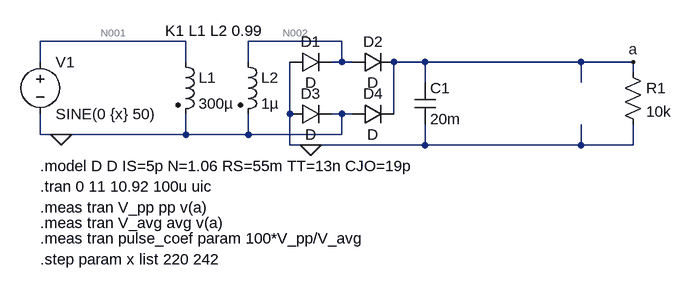
[diagram p0: schematic 2.8.1.asc]
2.8.1.asc, the LTspice schematic file:
Version 4
SHEET 1 1156 680
WIRE 320 80 96 80
WIRE 560 80 416 80
WIRE 96 112 96 80
WIRE 320 112 320 80
WIRE 416 112 416 80
WIRE 560 112 560 80
WIRE 560 112 544 112
WIRE 576 112 560 112
WIRE 688 112 640 112
WIRE 928 112 688 112
WIRE 1008 112 928 112
WIRE 1008 128 1008 112
WIRE 688 144 688 112
WIRE 928 144 928 112
WIRE 480 192 480 112
WIRE 560 192 544 192
WIRE 576 192 560 192
WIRE 640 192 640 112
WIRE 96 224 96 192
WIRE 128 224 96 224
WIRE 320 224 320 192
WIRE 320 224 128 224
WIRE 416 224 416 192
WIRE 416 224 320 224
WIRE 560 224 560 192
WIRE 560 224 416 224
WIRE 480 240 480 192
WIRE 512 240 480 240
WIRE 688 240 688 208
WIRE 688 240 512 240
WIRE 928 240 928 208
WIRE 928 240 688 240
WIRE 1008 240 1008 208
WIRE 1008 240 928 240
FLAG 128 224 0
FLAG 1008 112 a
FLAG 512 240 0
SYMBOL voltage 96 96 R0
WINDOW 123 0 0 Left 0
WINDOW 39 0 0 Left 0
SYMATTR InstName V1
SYMATTR Value SINE(0 {x} 50)
SYMBOL ind2 304 96 R0
SYMATTR InstName L1
SYMATTR Value 300µ
SYMATTR SpiceLine Rser=10m
SYMATTR Type ind
SYMBOL ind2 400 96 R0
SYMATTR InstName L2
SYMATTR Value 1µ
SYMATTR SpiceLine Rser=10m
SYMATTR Type ind
SYMBOL cap 672 144 R0
SYMATTR InstName C1
SYMATTR Value 20m
SYMBOL res 992 112 R0
SYMATTR InstName R1
SYMATTR Value 10k
SYMBOL diode 480 128 R270
WINDOW 0 32 32 VTop 2
WINDOW 3 0 32 VBottom 2
SYMATTR InstName D1
SYMBOL diode 576 128 R270
WINDOW 0 32 32 VTop 2
WINDOW 3 0 32 VBottom 2
SYMATTR InstName D2
SYMBOL diode 480 208 R270
WINDOW 0 32 32 VTop 2
WINDOW 3 0 32 VBottom 2
SYMATTR InstName D3
SYMBOL diode 576 208 R270
WINDOW 0 32 32 VTop 2
WINDOW 3 0 32 VBottom 2
SYMATTR InstName D4
TEXT 96 272 Left 2 !.model D D IS=5p N=1.06 RS=55m TT=13n CJO=19p
TEXT 288 64 Left 2 !K1 L1 L2 0.99
TEXT 96 304 Left 2 !.tran 0 11 10.92 100u uic
TEXT 96 336 Left 2 !.meas tran V_pp pp v(a)
TEXT 96 360 Left 2 !.meas tran V_avg avg v(a)
TEXT 96 384 Left 2 !.meas tran pulse_coef param 100*V_pp/V_avg
TEXT 96 416 Left 2 !.step param x list 220 242

The netlist it stands for:
* 2.8.1.asc
V1 N001 0 SINE(0 {x} 50)
L1 N001 0 300µ Rser=10m
L2 N002 0 1µ Rser=10m
C1 a 0 20m
R1 a 0 10k
D1 0 N002 D
D2 N002 a D
D3 0 0 D
D4 0 a D
.model D D
.lib standard.dio
.model D D IS=5p N=1.06 RS=55m TT=13n CJO=19p
K1 L1 L2 0.99
.tran 0 11 10.92 100u uic
.meas tran V_pp pp v(a)
.meas tran V_avg avg v(a)
.meas tran pulse_coef param 100*V_pp/V_avg
.step param x list 220 242
.backanno
.end

* Results of the author's LTspice run, read from the files saved beside the schematic
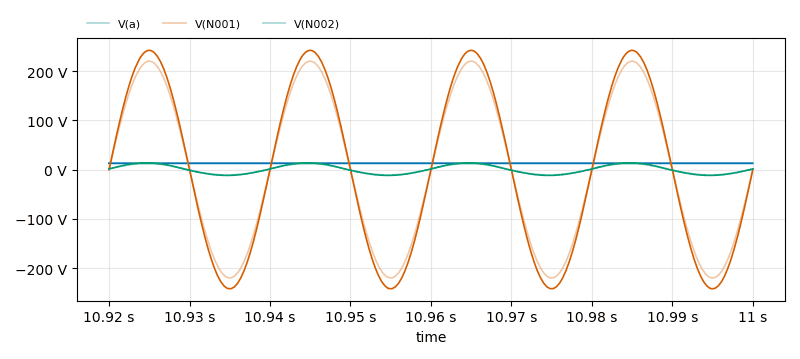
[diagram p1: Transient Analysis of 2.8.1.asc, plotted from the saved traces]
* Transient Analysis, 2 runs:
*   V(a) [x=220]: min 11.86 V, max 11.86 V, average 11.86 V, rms 11.86 V, last 11.86 V
*   V(a) [x=242]: min 13.11 V, max 13.11 V, average 13.11 V, rms 13.11 V, last 13.11 V
*   V(N001) [x=220]: min -219.9 V, max 220 V, average 27.26 mV, rms 155.6 V, last 0 V
*   V(N001) [x=242]: min -241.9 V, max 242 V, average 26.59 mV, rms 171.1 V, last 0 V
*   V(N002) [x=220]: min -10.7 V, max 12.5 V, average 550 mV, rms 8.241 V, last 1.317 V
*   V(N002) [x=242]: min -11.76 V, max 13.75 V, average 610.7 mV, rms 9.06 V, last 1.449 V
* From the log:
*   Measurement: v_pp
*     step  PP(v(a))  FROM  TO
*        1  0.00113487  0  0.08
*        2  0.0012598  0  0.08
*   Measurement: v_avg
*     step  AVG(v(a))  FROM  TO
*        1  11.862  0  0.08
*        2  13.1078  0  0.08
*   Measurement: pulse_coef
*     step  100*v_pp/v_avg
*        1  0.00956731
*        2  0.00961111